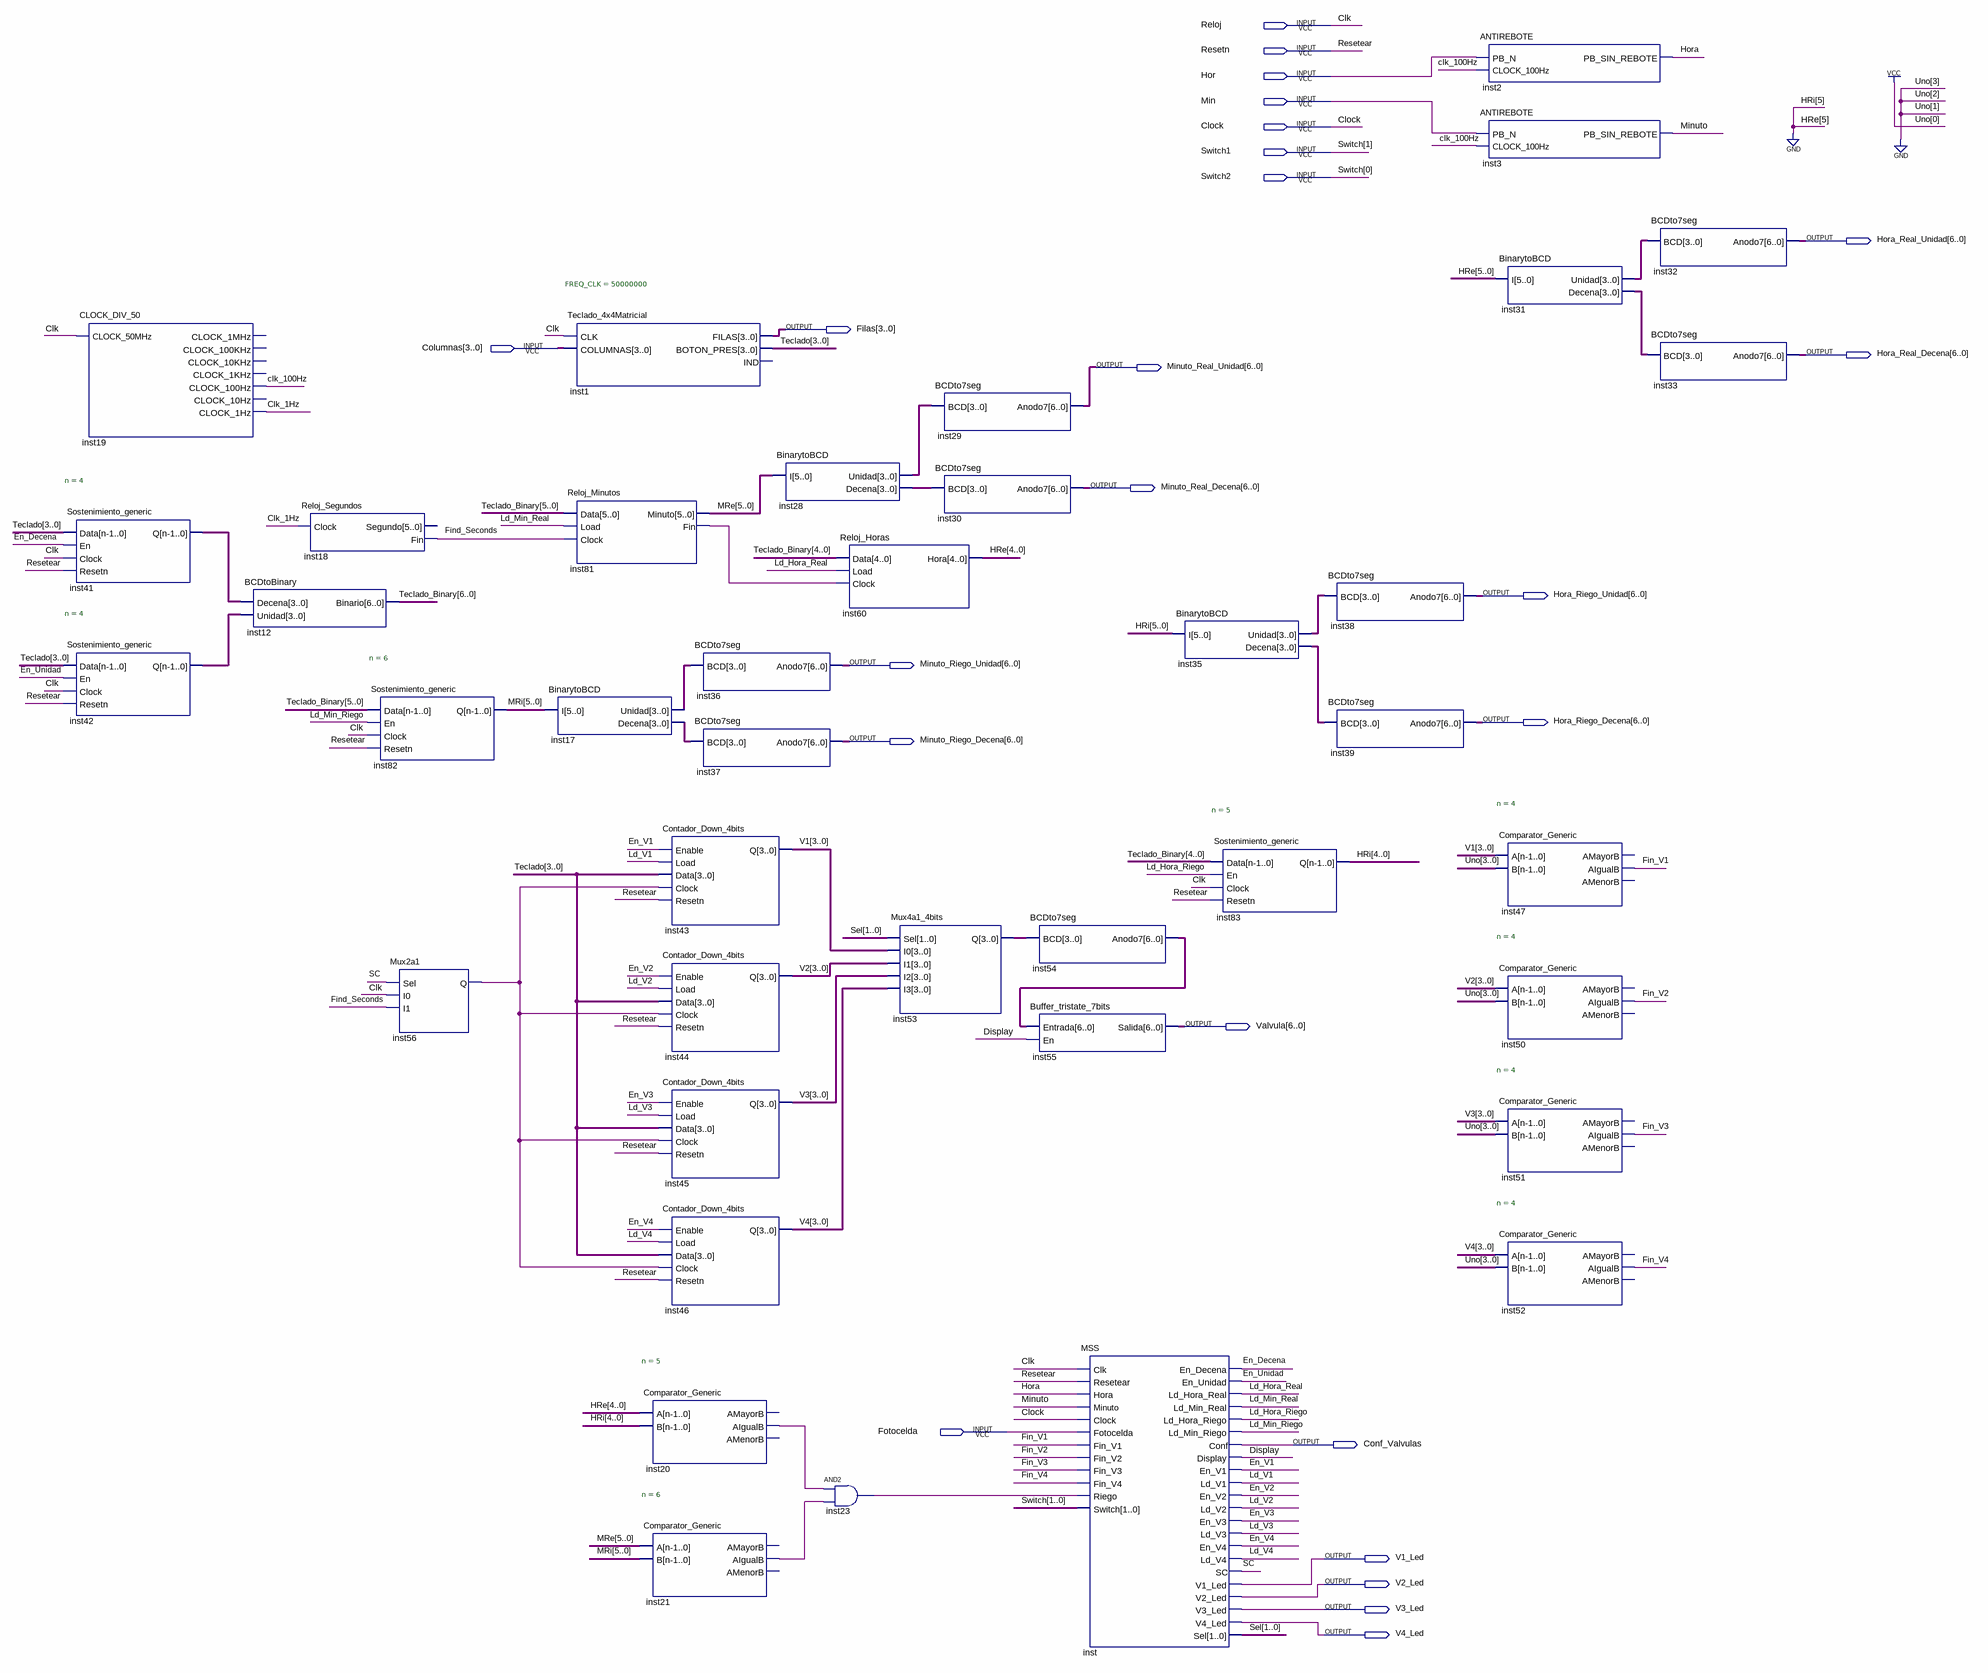
[diagram p0: schematic sheet]
// Quartus schematic Diagrama.bdf as structural Verilog: 40 symbols, 24 pins
module Diagrama (
  input  Reloj,
  input  Resetn,
  input  Hor,
  input  Min,
  input  Clock,
  input  Switch1,
  input  Switch2,
  input  [3:0] Columnas,
  input  Fotocelda,
  output [6:0] Hora_Real_Unidad,
  output [3:0] Filas,
  output [6:0] Hora_Real_Decena,
  output [6:0] Minuto_Real_Unidad,
  output [6:0] Minuto_Real_Decena,
  output [6:0] Hora_Riego_Unidad,
  output [6:0] Minuto_Riego_Unidad,
  output [6:0] Hora_Riego_Decena,
  output [6:0] Minuto_Riego_Decena,
  output [6:0] Valvula,
  output Conf_Valvulas,
  output V1_Led,
  output V2_Led,
  output V3_Led,
  output V4_Led
);

  wire Clk_1Hz, clk_100Hz, Display, En_Decena, En_Unidad, En_V1, En_V2, En_V3, En_V4, Fin_V1, Fin_V2, Fin_V3,
       Fin_V4, Find_Seconds, Hora, inst20_aigualb, inst21_aigualb, inst23_out, inst56_q, inst81_fin,
       Ld_Hora_Real, Ld_Hora_Riego, Ld_Min_Real, Ld_Min_Riego, Ld_V1, Ld_V2, Ld_V3, Ld_V4, Minuto, SC;
  wire [1:0] Sel;
  wire [3:0] inst17_decena, inst17_unidad, inst28_decena, inst28_unidad, inst31_decena, inst31_unidad,
       inst35_decena, inst35_unidad, inst41_q, inst42_q, inst53_q, Teclado, V1, V2, V3, V4;
  wire [4:0] HRe, HRi;
  wire [5:0] MRe, MRi;
  wire [6:0] inst54_anodo7, Teclado_Binary;

  Sostenimiento_generic #(.n(4)) inst41 (.Data(Teclado), .En(En_Decena), .Clock(Reloj), .Resetn(Resetn), .Q(inst41_q));
  Sostenimiento_generic #(.n(4)) inst42 (.Data(Teclado), .En(En_Unidad), .Clock(Reloj), .Resetn(Resetn), .Q(inst42_q));
  CLOCK_DIV_50 inst19 (
    .CLOCK_50MHz(Reloj), .CLOCK_100Hz(clk_100Hz), .CLOCK_1Hz(Clk_1Hz));  // open: CLOCK_1MHz, CLOCK_100KHz, CLOCK_10KHz, CLOCK_1KHz, CLOCK_10Hz
  BCDtoBinary inst12 (.Decena(inst41_q), .Unidad(inst42_q), .Binario(Teclado_Binary));
  Reloj_Segundos inst18 (.Clock(Clk_1Hz), .Fin(Find_Seconds));  // open: Segundo
  Sostenimiento_generic #(.n(6)) inst82 (
    .Data(Teclado_Binary[5:0]), .En(Ld_Min_Riego), .Clock(Reloj), .Resetn(Resetn), .Q(MRi));
  Mux2a1 inst56 (.Sel(SC), .I0(Reloj), .I1(Find_Seconds), .Q(inst56_q));
  Teclado_4x4Matricial #(.FREQ_CLK(50000000)) inst1 (
    .CLK(Reloj), .COLUMNAS(Columnas), .FILAS(Filas), .BOTON_PRES(Teclado));  // open: IND
  Reloj_Minutos inst81 (
    .Data(Teclado_Binary[5:0]), .Load(Ld_Min_Real), .Clock(Find_Seconds), .Minuto(MRe), .Fin(inst81_fin));
  BinarytoBCD inst17 (.I(MRi), .Unidad(inst17_unidad), .Decena(inst17_decena));
  Contador_Down_4bits inst43 (.Enable(En_V1), .Load(Ld_V1), .Data(Teclado), .Clock(inst56_q), .Resetn(Resetn), .Q(V1));
  Contador_Down_4bits inst44 (.Enable(En_V2), .Load(Ld_V2), .Data(Teclado), .Clock(inst56_q), .Resetn(Resetn), .Q(V2));
  Contador_Down_4bits inst45 (.Enable(En_V3), .Load(Ld_V3), .Data(Teclado), .Clock(inst56_q), .Resetn(Resetn), .Q(V3));
  Contador_Down_4bits inst46 (.Enable(En_V4), .Load(Ld_V4), .Data(Teclado), .Clock(inst56_q), .Resetn(Resetn), .Q(V4));
  Comparator_Generic #(.n(5)) inst20 (.A(HRe), .B(HRi), .AIgualB(inst20_aigualb));  // open: AMayorB, AMenorB
  Comparator_Generic #(.n(6)) inst21 (.A(MRe), .B(MRi), .AIgualB(inst21_aigualb));  // open: AMayorB, AMenorB
  BCDto7seg inst36 (.BCD(inst17_unidad), .Anodo7(Minuto_Riego_Unidad));
  BCDto7seg inst37 (.BCD(inst17_decena), .Anodo7(Minuto_Riego_Decena));
  BinarytoBCD inst28 (.I(MRe), .Unidad(inst28_unidad), .Decena(inst28_decena));
  and inst23 (inst23_out, inst20_aigualb, inst21_aigualb);
  Reloj_Horas inst60 (.Data(Teclado_Binary[4:0]), .Load(Ld_Hora_Real), .Clock(inst81_fin), .Hora(HRe));
  Mux4a1_4bits inst53 (.Sel(Sel), .I0(V1), .I1(V2), .I2(V3), .I3(V4), .Q(inst53_q));
  BCDto7seg inst29 (.BCD(inst28_unidad), .Anodo7(Minuto_Real_Unidad));
  BCDto7seg inst30 (.BCD(inst28_decena), .Anodo7(Minuto_Real_Decena));
  BCDto7seg inst54 (.BCD(inst53_q), .Anodo7(inst54_anodo7));
  Buffer_tristate_7bits inst55 (.Entrada(inst54_anodo7), .En(Display), .Salida(Valvula));
  MSS inst (
    .Clk(Reloj), .Resetear(Resetn), .Hora(Hora), .Minuto(Minuto), .Clock(Clock), .Fotocelda(Fotocelda),
    .Fin_V1(Fin_V1), .Fin_V2(Fin_V2), .Fin_V3(Fin_V3), .Fin_V4(Fin_V4), .Riego(inst23_out),
    .Switch({Switch1, Switch2}), .En_Decena(En_Decena), .En_Unidad(En_Unidad), .Ld_Hora_Real(Ld_Hora_Real),
    .Ld_Min_Real(Ld_Min_Real), .Ld_Hora_Riego(Ld_Hora_Riego), .Ld_Min_Riego(Ld_Min_Riego),
    .Conf(Conf_Valvulas), .Display(Display), .En_V1(En_V1), .Ld_V1(Ld_V1), .En_V2(En_V2), .Ld_V2(Ld_V2),
    .En_V3(En_V3), .Ld_V3(Ld_V3), .En_V4(En_V4), .Ld_V4(Ld_V4), .SC(SC), .V1_Led(V1_Led), .V2_Led(V2_Led),
    .V3_Led(V3_Led), .V4_Led(V4_Led), .Sel(Sel));
  BinarytoBCD inst35 (.I({1'b0, HRi}), .Unidad(inst35_unidad), .Decena(inst35_decena));
  Sostenimiento_generic #(.n(5)) inst83 (
    .Data(Teclado_Binary[4:0]), .En(Ld_Hora_Riego), .Clock(Reloj), .Resetn(Resetn), .Q(HRi));
  BCDto7seg inst38 (.BCD(inst35_unidad), .Anodo7(Hora_Riego_Unidad));
  BCDto7seg inst39 (.BCD(inst35_decena), .Anodo7(Hora_Riego_Decena));
  ANTIREBOTE inst2 (.PB_N(Hor), .CLOCK_100Hz(clk_100Hz), .PB_SIN_REBOTE(Hora));
  ANTIREBOTE inst3 (.PB_N(Min), .CLOCK_100Hz(clk_100Hz), .PB_SIN_REBOTE(Minuto));
  BinarytoBCD inst31 (.I({1'b0, HRe}), .Unidad(inst31_unidad), .Decena(inst31_decena));
  Comparator_Generic #(.n(4)) inst47 (.A(V1), .B(4'b0001), .AIgualB(Fin_V1));  // open: AMayorB, AMenorB
  Comparator_Generic #(.n(4)) inst50 (.A(V2), .B(4'b0001), .AIgualB(Fin_V2));  // open: AMayorB, AMenorB
  Comparator_Generic #(.n(4)) inst51 (.A(V3), .B(4'b0001), .AIgualB(Fin_V3));  // open: AMayorB, AMenorB
  Comparator_Generic #(.n(4)) inst52 (.A(V4), .B(4'b0001), .AIgualB(Fin_V4));  // open: AMayorB, AMenorB
  BCDto7seg inst32 (.BCD(inst31_unidad), .Anodo7(Hora_Real_Unidad));
  BCDto7seg inst33 (.BCD(inst31_decena), .Anodo7(Hora_Real_Decena));

  // Other names for the same wires on the sheet: Clk = Reloj; Resetear = Resetn; Switch[0] = Switch2
endmodule
